# Altium schematic sheet captain_phillips.SchDoc
size Letter; SheetNumber: 2; SheetTotal: 8
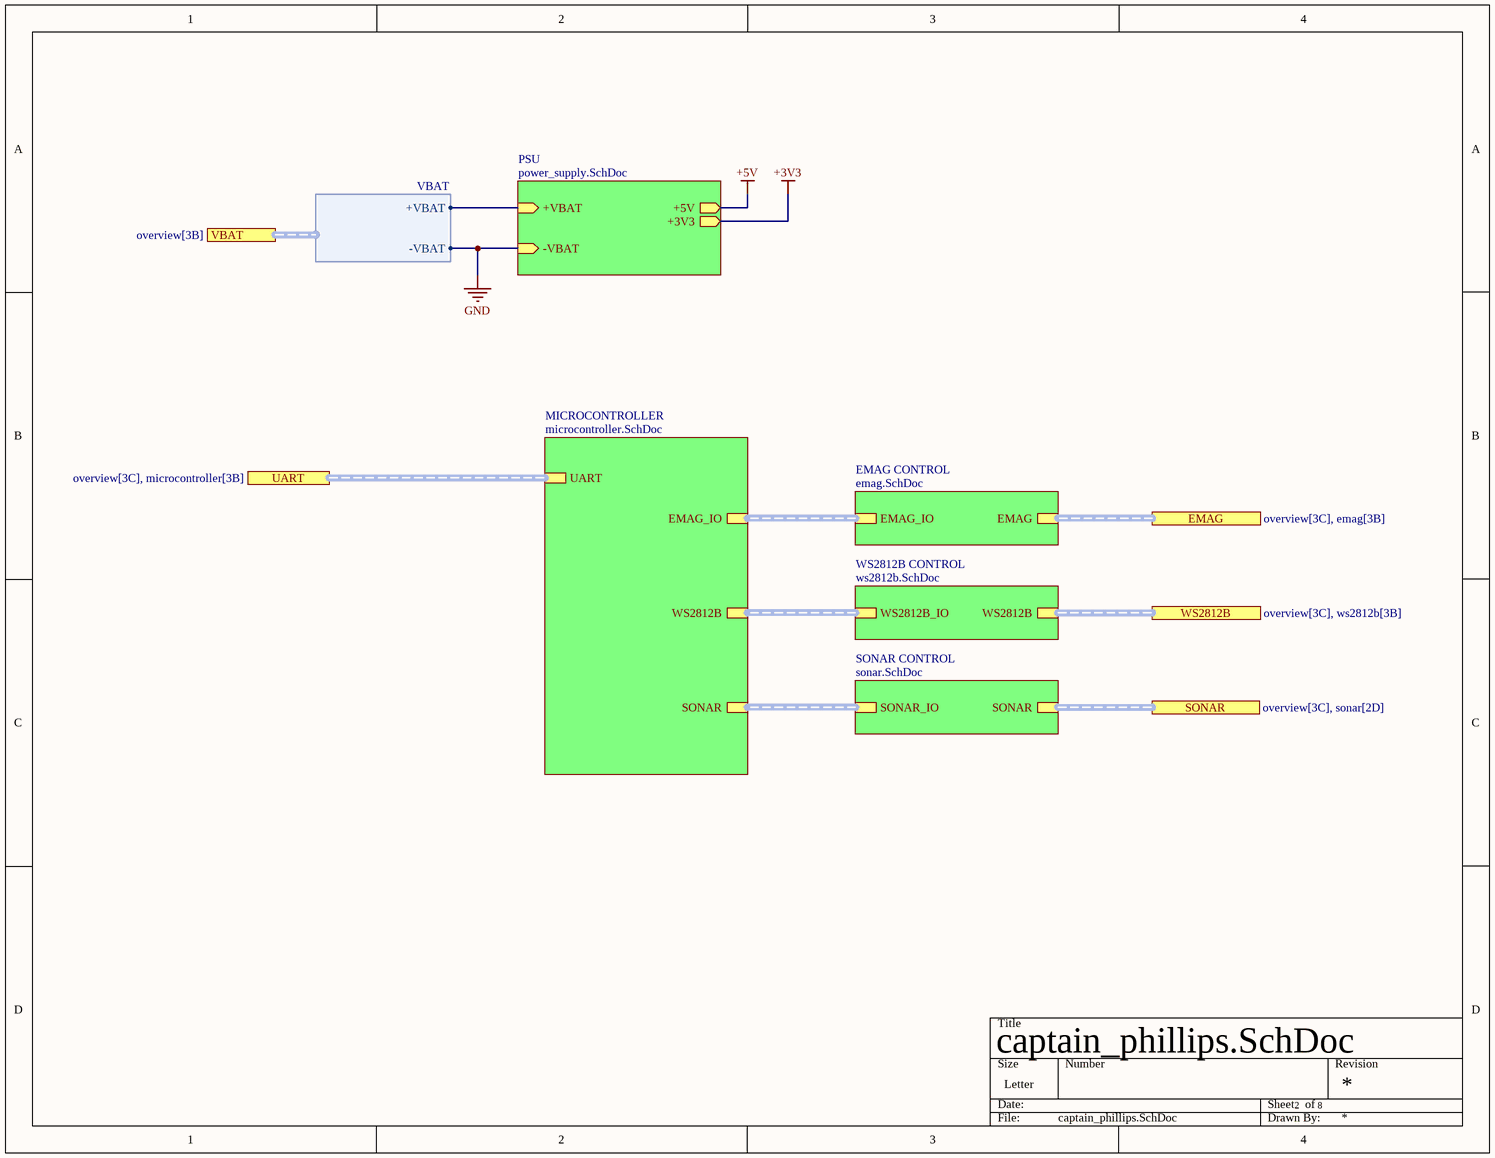
[diagram p0: captain_phillips.SchDoc]

## Sub-sheets
EMAG CONTROL = emag.SchDoc: EMAG, EMAG_IO
MICROCONTROLLER = microcontroller.SchDoc: UART, SONAR, WS2812B, EMAG_IO
PSU = power_supply.SchDoc: +VBAT (in), -VBAT (in), +5V (out), +3V3 (out)
SONAR CONTROL = sonar.SchDoc: SONAR_IO, SONAR
WS2812B CONTROL = ws2812b.SchDoc: WS2812B_IO, WS2812B

## Ports
EMAG (see overview[3C], emag[3B]), SONAR (see overview[3C], sonar[2D]), UART (see overview[3C], microcontroller[3B]), VBAT (harness VBAT, see overview[3B]), WS2812B (see overview[3C], ws2812b[3B])

## Harnesses
VBAT: +VBAT, -VBAT

## Nets
+3V3: sheet PSU/+3V3
+5V: sheet PSU/+5V
GND: sheet PSU/-VBAT, port VBAT.-VBAT
(unnamed): sheet PSU/+VBAT, port VBAT.+VBAT

## Buses and harness runs
harness port EMAG = sheet EMAG CONTROL/EMAG
harness port SONAR = sheet SONAR CONTROL/SONAR
harness port UART = sheet MICROCONTROLLER/UART
harness port WS2812B = sheet WS2812B CONTROL/WS2812B
harness sheet EMAG CONTROL/EMAG_IO = sheet MICROCONTROLLER/EMAG_IO
harness sheet MICROCONTROLLER/SONAR = sheet SONAR CONTROL/SONAR_IO
harness sheet MICROCONTROLLER/WS2812B = sheet WS2812B CONTROL/WS2812B_IO